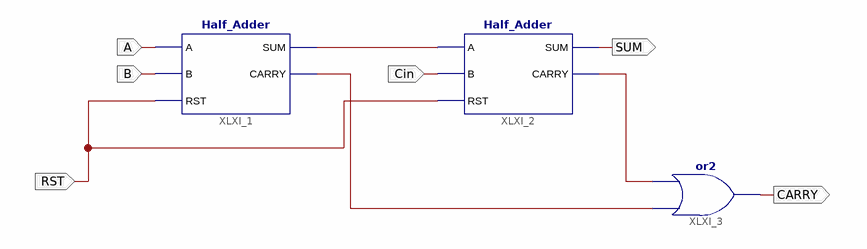
[diagram p0: schematic sheet 1]
// Xilinx ISE schematic Full_Adder.sch (spartan6) as structural Verilog: 3 symbols, 6 ports
module Full_Adder (
  input  RST,
  input  A,
  input  B,
  input  Cin,
  output SUM,
  output CARRY
);

  wire XLXN_1, XLXN_2, XLXN_3;

  Half_Adder XLXI_1 (.A(A), .B(B), .CARRY(XLXN_3), .RST(RST), .SUM(XLXN_1));
  Half_Adder XLXI_2 (.A(XLXN_1), .B(Cin), .CARRY(XLXN_2), .RST(RST), .SUM(SUM));
  or XLXI_3 (CARRY, XLXN_3, XLXN_2);
endmodule
